# EAGLE design Tmp102_v10 (EAGLE 6.2)
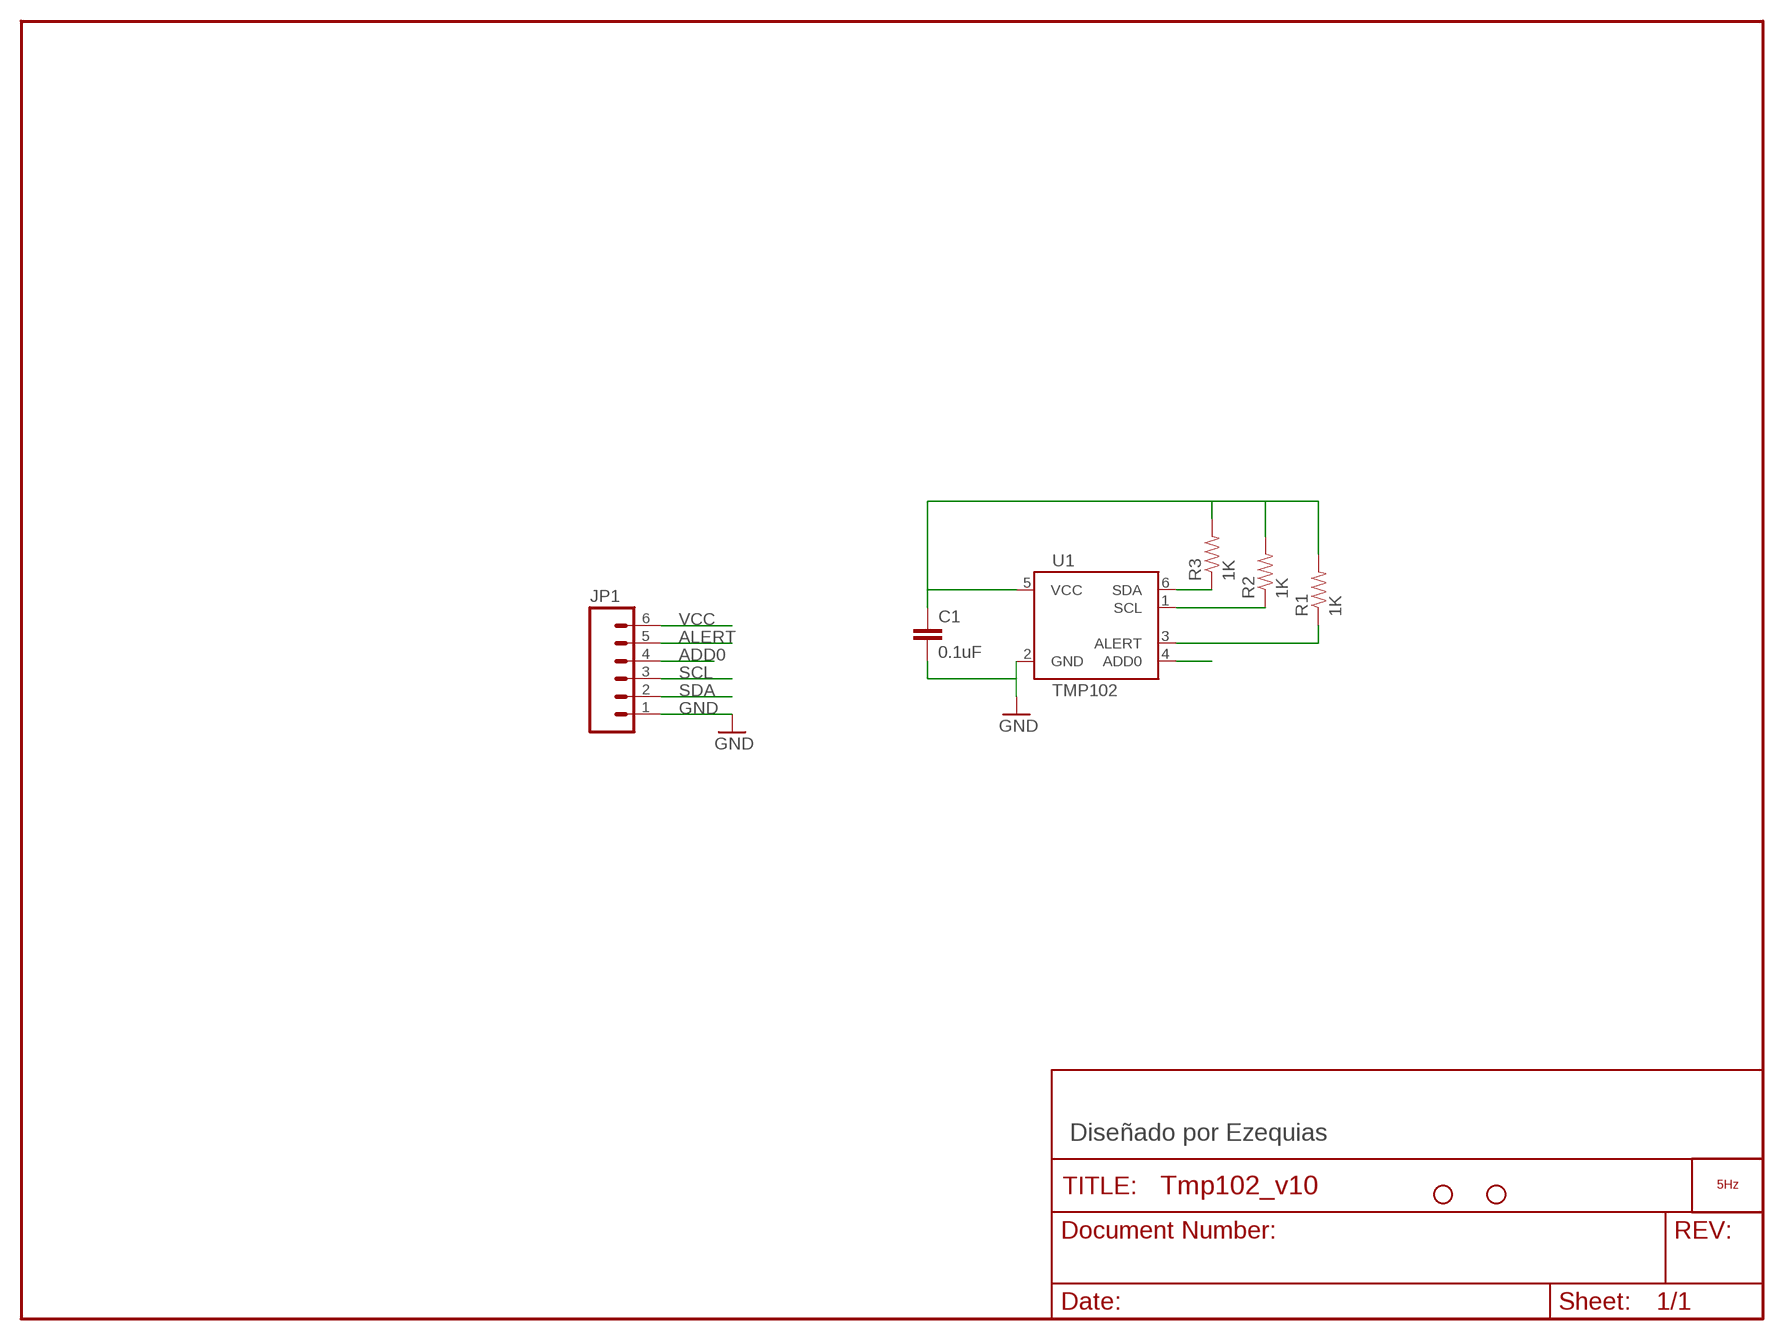
[diagram p0: schematic, sheet 1]

## Parts
C1  0.1uF  CAP0603-CAP  [0603-CAP]
JP1  M06SIP  [1X06]
JP2  STAND-OFF  [STAND-OFF]
JP3  STAND-OFF  [STAND-OFF]
LOGO1  LOGO_5HZ_MAIN_5MM  [5HZ_LOGO_MAIN_5MM]
R1  1K  RESISTOR0603-RES  [0603-RES]
R2  1K  RESISTOR0603-RES  [0603-RES]
R3  1K  RESISTOR0603-RES  [0603-RES]
U1  TMP102  [SOT563]

## Nets
ADD0: JP1.4 U1.4(ADD0)
ALERT: JP1.5 R1.1 U1.3(ALERT)
GND: C1.2 JP1.1 U1.2(GND)
SCL: JP1.3 R2.1 U1.1(SCL)
SDA: JP1.2 R3.1 U1.6(SDA)
VCC: C1.1 JP1.6 R1.2 R2.2 R3.2 U1.5(VCC)

## Notes on the sheet
- Diseñado por Ezequias

## Library data of the parts
C1 = SparkFun:CAP: Capacitor Standard 0603 ceramic capacitor, and 0.1" leaded capacitor.
JP1 = SparkFun:M06: Header 6 Standard 6-pin 0.1" header. Use with straight break away headers (SKU : PRT-00116), right angle break away headers (PRT-00553), swiss pins (PRT-00743), machine pins (PRT-00117), and female headers (PRT-00115). Molex polarized connector foot print use with SKU : PRT-08094 with associated crimp pins and housings. NOTES ON THE VARIANTS LOCK and LOCK_LONGPADS... This footprint was designed to help hold the alignment of a through-hole component (i.e. 6-pin header) while soldering it into place. You may notice that each hole has been shifted either up or down by 0.005 of an inch from it's more standard position (which is a perfectly straight line). This slight alteration caused the pins (the squares in the middle) to touch the edges of the holes. Because they are alternating, it causes a "brace" to hold the component in place. 0.005 has proven to be the perfect amount of "off-center" position when using our standard breakaway headers. Although looks a little odd when you look at the bare footprint, once you have a header in there, the alteration is very hard to notice. Also, if you push a header all the way into place, it is covered up entirely on the bottom side. This idea of altering the position of holes to aid alignment will be further integrated into the Sparkfun Library for other footprints. It can help hold any component with 3 or more connection pins.
JP2 JP3 = SparkFun:STAND-OFF: Stand Off This is the mechanical footprint for a #4 phillips button head screw. Use the keepout ring to avoid running the screw head into surrounding components. SKU : PRT-00447
LOGO1 = 5hz-electronica:LOGO_5HZ: Logotipo 5Hz "según Pedro"
R1-R3 = SparkFun:RESISTOR: Resistor Basic schematic elements and footprints for 0603, 1206, and PTH resistors.
U1 = SparkFun:TMP102

## Board
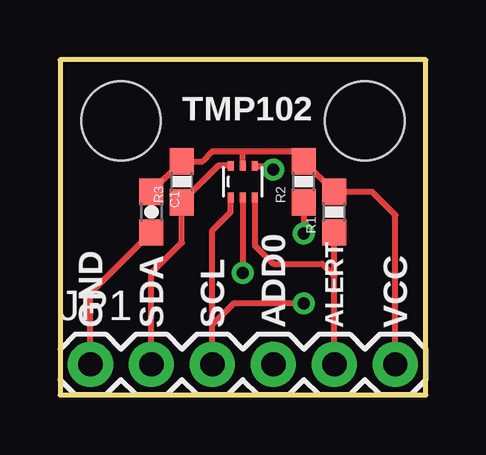
[diagram p1: board, top side]
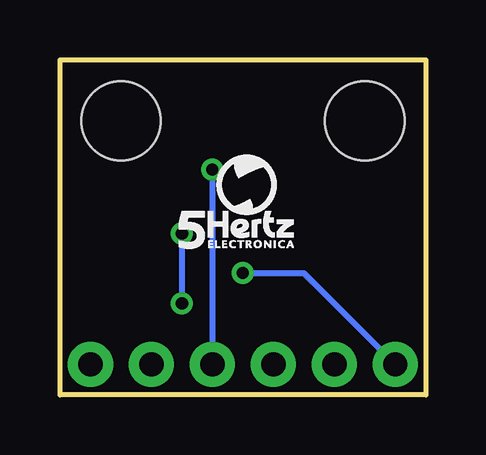
[diagram p2: board, bottom side, seen from below]

Size 15.24 x 13.97 mm. Coordinates in mm from the lower left corner, seen from the top.
Outline: 0,0 15.24,0 15.24,13.97 0,13.97 0,0
Copper layers (1*16): Top 0.035mm / dielectric 1.5mm / Bottom 0.035mm
Design rules: minimum track width 10mil, minimum drill 24mil, track to track 8mil, track to pad 8mil, pad to pad 8mil, via to via 8mil, smd to smd 8mil, copper to edge 40mil, drill to drill 8mil, minimum pad ring 10mil, minimum via ring 8mil, stop-mask expansion 4mil, vias tented up to drill 0mil, thermal gap 10mil

### Footprints (pad centres in the part's own frame; a part is rotated, then mirrored left to right if it is on the bottom)
0603-CAP = smd 1.1 x 1: 1 -0.85,0; 2 0.85,0
1X06 = drill 1.016 pad 1.88: 1 0,0; 2 2.54,0; 3 5.08,0; 4 7.62,0; 5 10.16,0; 6 12.7,0
STAND-OFF = hole 3.302: 0,0
0603-RES = smd 1.1 x 1: 1 -0.85,0; 2 0.85,0
SOT563 = smd 0.25 x 0.4: 1 -0.5,-0.66; 2 0,-0.66; 3 0.5,-0.66; 4 0.5,0.66; 5 0,0.66; 6 -0.5,0.67

### Placement (x,y rotation side)
C1  3.81,7.62 270 top
JP1  1.27,1.27 0 top
JP2  2.54,11.43 0 top
JP3  12.7,11.43 0 top
LOGO1  10.29,6.1 0 bottom
R1  11.43,7.62 90 top
R2  10.16,8.89 90 top
R3  5.08,8.89 90 top
U1  7.62,8.89 0 top

### Tracks (layer width: path | path; a pad name or v marks a point on that pad's centre or on a via)
ADD0  (via drill 0.51)
  Top 0.254: U1.4 8.74,9.55 v8.89,9.4
  Bottom 0.254: v8.89,9.4 JP1.4
ALERT
  Top 0.254: JP1.5 11.43,4.95 | 11.43,4.95 R1.1 | U1.3 8.12,6.23 8.89,5.46 10.92,5.46 11.43,4.95
GND  (via drill 0.51)
  Top 0.254: JP1.1 1.27,4.23 C1.2 | U1.2 v7.62,5.08
  Bottom 0.254: v7.62,5.08 5.08,5.08 JP1.1
SCL  (via drill 0.51)
  Top 0.254: JP1.3 6.35,2.92 | 6.35,2.92 6.35,6.86 7.11,7.62 U1.1 | R2.1 v10.16,6.73 | v10.16,3.81 7.24,3.81 6.35,2.92
  Bottom 0.254: v10.16,6.73 v10.16,3.81
SDA
  Top 0.254: JP1.2 3.81,5.08 5.08,6.35 R3.1 6.6,9.56 U1.6
VCC
  Top 0.254: JP1.6 13.97,7.49 12.99,8.47 R1.2 R2.2 9.74,10.16 7.62,10.16 | C1.1 R3.2 5.93,9.74 6.35,10.16 7.62,10.16 | U1.5 7.62,10.16

### Text on the board
tPlace: TMP102 | GND | SDA | SCL | ADD0 | ALERT | VCC